# EasyEDA schematic SCH_stm32f407modular_2024-06-24.json
TITLE: Sheet_1; REV: 1.0; Date: 2024-01-05; Sheet: 1/1; Drawn By: Araf Israk; Company: Your Company
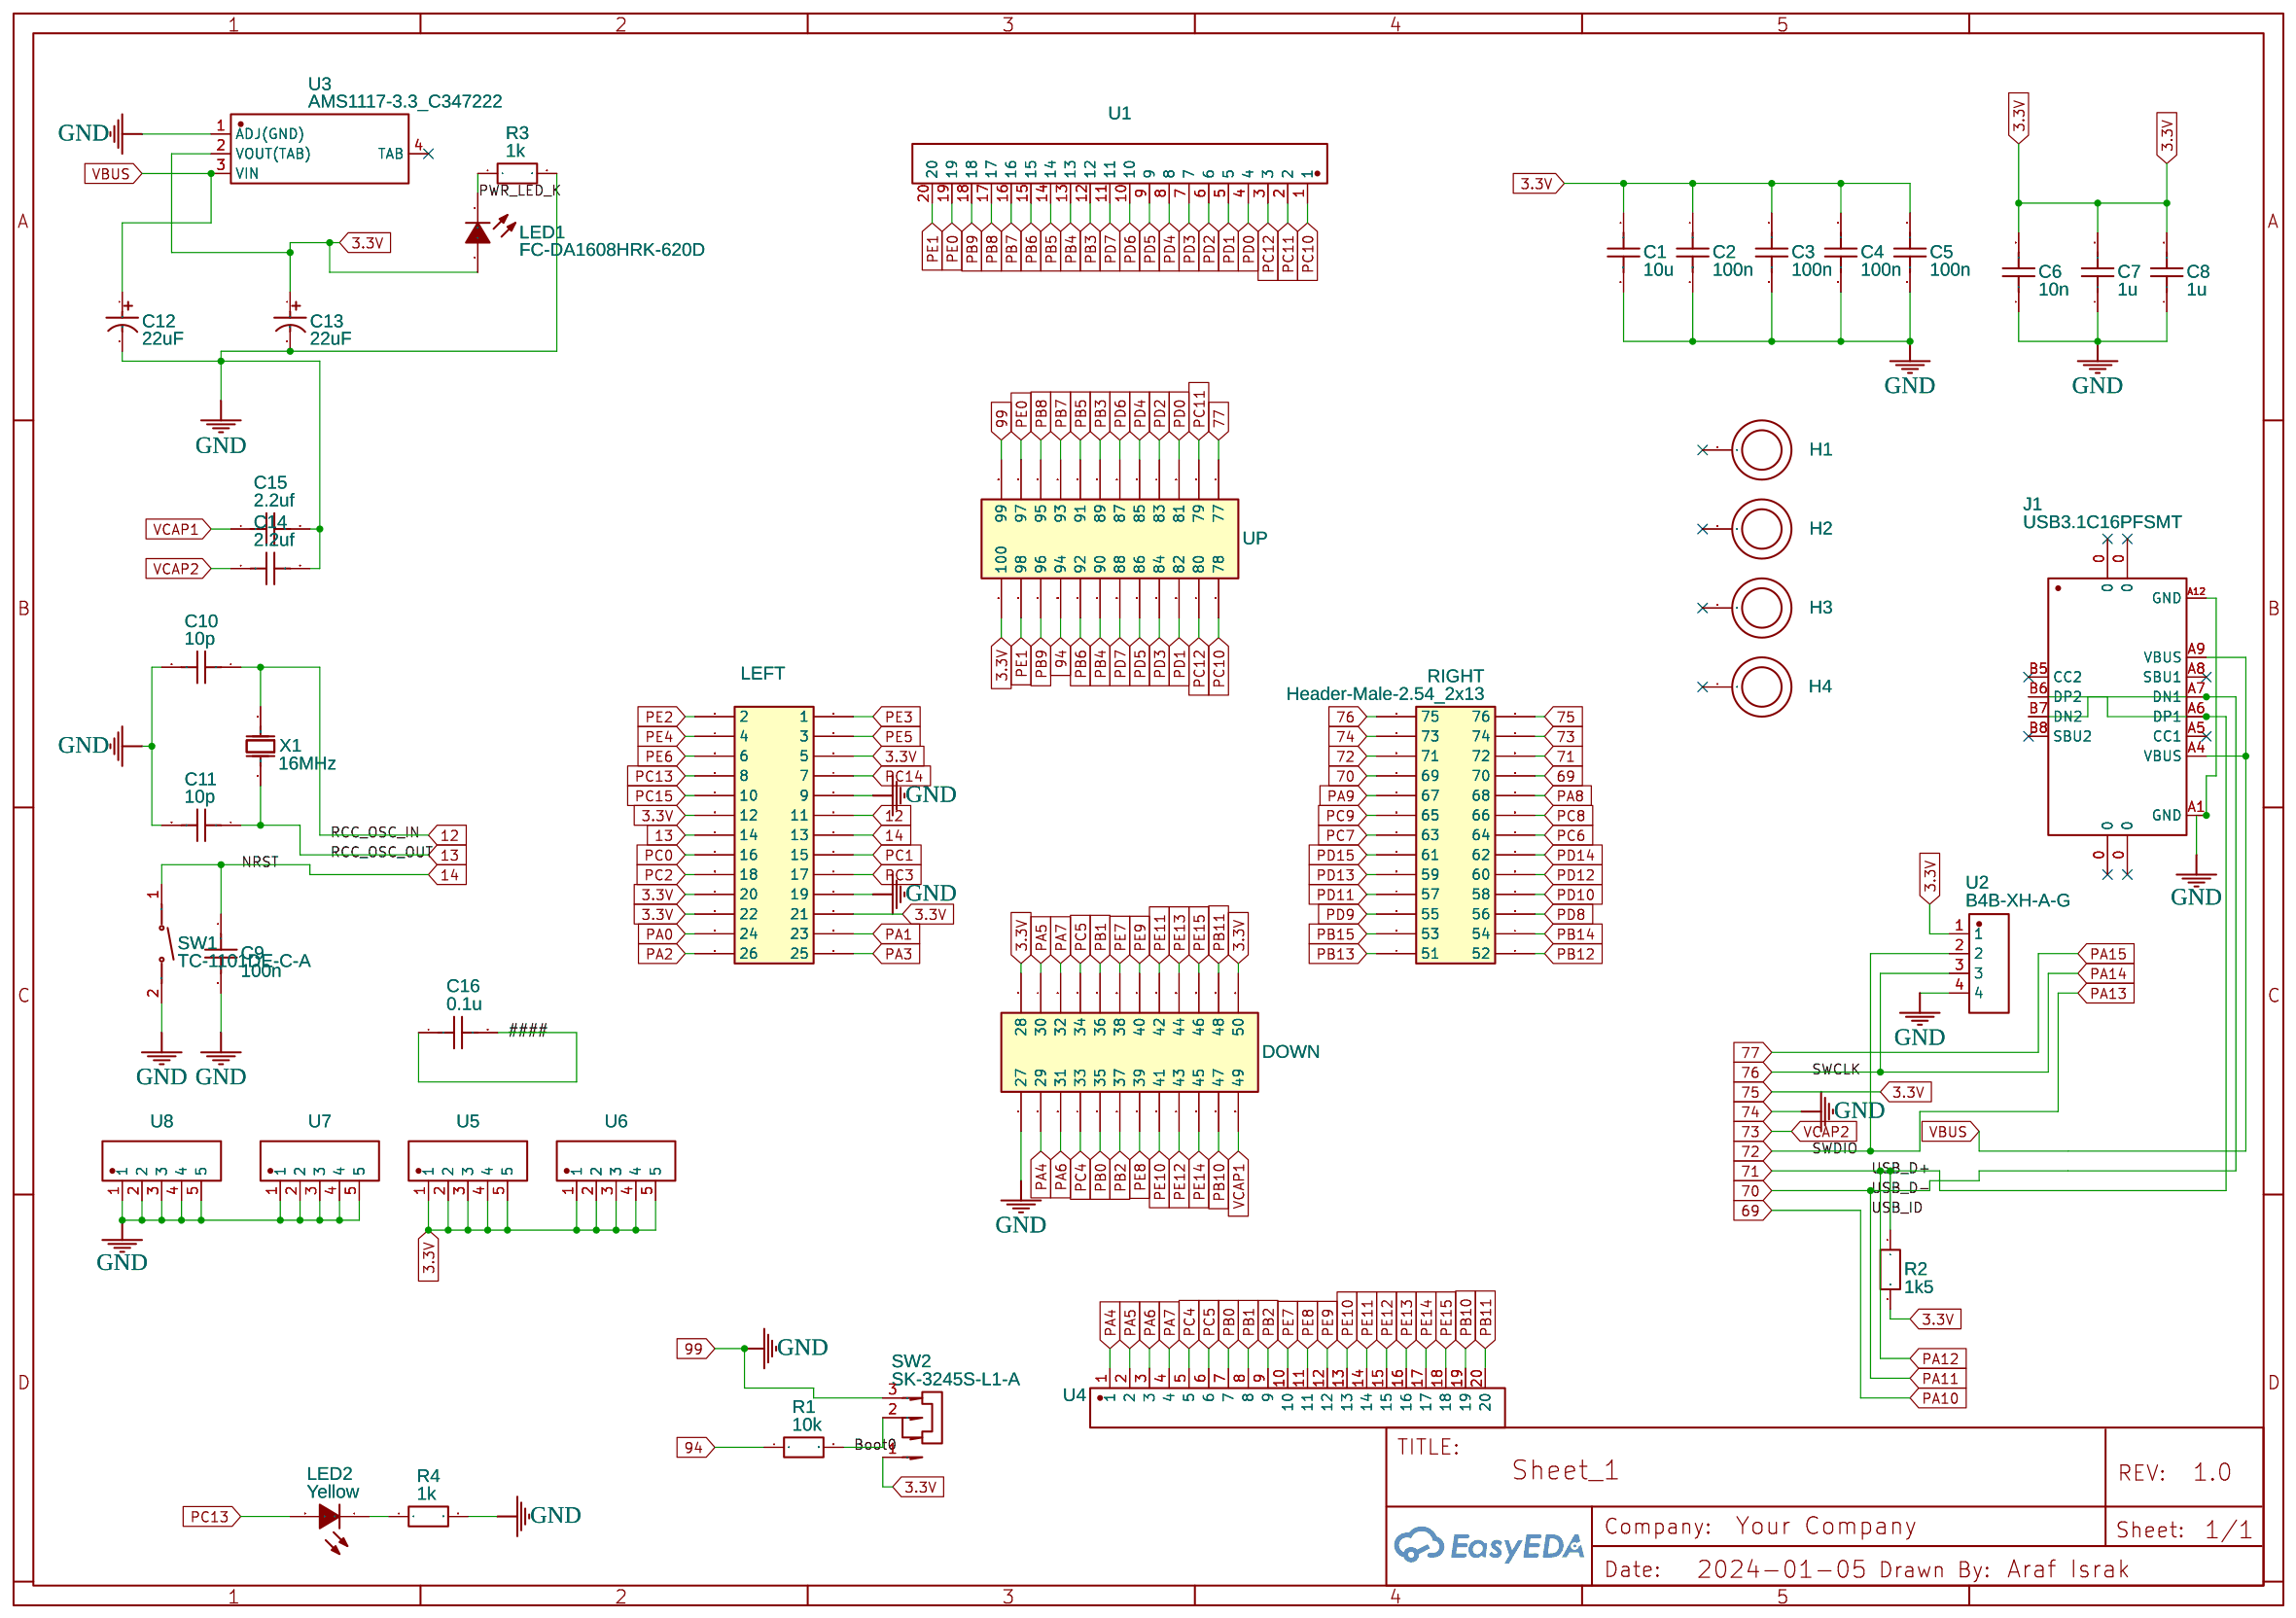
[diagram p0: schematic sheet]

## Parts
C1  10u  [C1206]
C2  100n  [C1206]
C3  100n  [C1206]
C4  100n  [C1206]
C5  100n  [C1206]
C6  10n  [C1206]
C7  1u  [C1206]
C8  1u  [C1206]
C9  100n  [C1206]
C10  10p  [C1206]
C11  10p  [C1206]
C12  22uF  [CAP-SMD_BD5.0-L5.3-W5.3-LS6.3-FD]
C13  22uF  [CAP-SMD_BD5.0-L5.3-W5.3-LS6.3-FD]
C14  2.2uf  [C1206]
C15  2.2uf  [C1206]
C16  0.1u  [C0603]
DOWN  Header-Female-2.54_2x12 copy  [HDR2X12]
H1  MOUNTINGHOLE_3.2MM_M3  [HOLEHOLE]
H2  MOUNTINGHOLE_3.2MM_M3  [HOLEHOLE]
H3  MOUNTINGHOLE_3.2MM_M3  [HOLEHOLE]
H4  MOUNTINGHOLE_3.2MM_M3  [HOLEHOLE]
J1  USB3.1C16PFSMT  [USB-C-SMD_TYPE-C-USB-17]
LED1  FC-DA1608HRK-620D  [LED0603-RD_RED]
LED2  Yellow  [LED0603-RD_RED]
LEFT  Header-Male-2.54_2x13  [HEADER_2.24_2X13_MOTOROLA]
R1  10k  [R1206]
R2  1k5  [R1206]
R3  1k  [R1206]
R4  1k  [R1206]
RIGHT  Header-Male-2.54_2x13  [HEADER_2.24_2X13_MOTOROLA]
SW1  TC-1101DE-C-A  [KEY-TH_L6.1-W3.8-P5.08]
SW2  SK-3245S-L1-A  [SW-SMD_SK-3245S-L1-A-1]
U1  P125-1120A0BR138A1  [HDR-TH_20P-P2.54-H-M-W9.7]
U2  B4B-XH-A-G  [CONN-TH_B4B-XH-A-G]
U3  AMS1117-3.3_C347222  [SOT-223-4_L6.5-W3.5-P2.30-LS7.0-BR]
U4  P125-1120A0BR138A1  [HDR-TH_20P-P2.54-H-M-W9.7]
U5  P125-1105A0BR138A1  [HDR-TH_5P-P2.54-H-M-W10.4]
U6  P125-1105A0BR138A1  [HDR-TH_5P-P2.54-H-M-W10.4]
U7  P125-1105A0BR138A1  [HDR-TH_5P-P2.54-H-M-W10.4]
U8  P125-1105A0BR138A1  [HDR-TH_5P-P2.54-H-M-W10.4]
UP  Header-Female-2.54_2x12 copy  [HDR2X12]
X1  16MHz  [CRYSTAL-TH_L11.1-W4.7]

## Library data of the parts
C1-C11 C14-C16 = C_0603_US: Contributor: LCEDA_Lib
C12 C13 = RVT1V220M0505: Supplier: LCSC; Manufacturer: ROQANG(容强); Supplier Part: C72504; JLCPCB Part Class: Extended Part; link: https://lcsc.com/eda_search?q=C72504&%26type=1&ref=editor
DOWN UP = Header-Female-2.54_2x12 copy: EasyEDA: C64320; Supplier Part: C64320; Supplier: EasyEDA; Manufacturer: EasyEDA; Manufacturer Part: Header-Female-2.54_2x13
H1-H4 = MOUNTINGHOLE_3.2MM_M3: Contributor: Cillié Malan
J1 = USB3.1C16PFSMT: Supplier: LCSC; Supplier Part: C167321; Manufacturer: LCSC; Contributor: hds110323; JLCPCB Part Class: Extended Part
LED1 LED2 = FC-DA1608HRK-620D: Supplier: LCSC; Manufacturer: 国星光电; Manufacturer Part: NCD0603R1; Supplier Part: C84263; JLCPCB Part Class: Extended Part; link: https://lcsc.com/eda_search?q=C84263&%26type=1&ref=editor
LEFT RIGHT = Header-Male-2.54_2x13: Contributor: ikrajinovic
R1-R4 = R_0603_EU: Contributor: LCEDA_Lib
SW1 = TC-1101DE-C-A: Contributor: LCSC; Supplier: LCSC; Supplier Part: C318995; Manufacturer: XKB Connectivity(中国星坤); JLCPCB Part Class: Extended Part; link: https://lcsc.com/eda_search?q=C318995&%26type=1&ref=editor
SW2 = SK-3245S-L1-A: Contributor: LCSC; Supplier: LCSC; Supplier Part: C405951; Manufacturer: XKB Connectivity(中国星坤); JLCPCB Part Class: Extended Part; link: https://lcsc.com/eda_search?q=C405951&%26type=1&ref=editor
U1 U4 = P125-1120A0BR138A1: Supplier: LCSC; Supplier Part: C19190491; Manufacturer: Yxcon(宇熙精密); Contributor: lcsc
U2 = B4B-XH-A-G: Contributor: LCSC; Supplier: LCSC; Supplier Part: C594232; Manufacturer: JST; JLCPCB Part Class: Extended Part; link: https://lcsc.com/eda_search?q=C594232&%26type=1&ref=editor
U3 = AMS1117-3.3_C347222: Contributor: LCSC; Supplier: LCSC; Supplier Part: C347222; Manufacturer: UMW(广东友台半导体); Manufacturer Part: AMS1117-3.3; JLCPCB Part Class: Extended Part; link: https://lcsc.com/eda_search?q=C347222&%26type=1&ref=editor
U5-U8 = P125-1105A0BR138A1: Supplier: LCSC; Supplier Part: C19190479; Manufacturer: Yxcon(宇熙精密); Contributor: lcsc
X1 = S1C12000ZWFAC: Contributor: LCSC; Supplier: LCSC; Supplier Part: C2149380; Manufacturer: JYJE(晶友嘉); JLCPCB Part Class: Extended Part; link: https://lcsc.com/eda_search?q=C2149380&%26type=1&ref=editor

## Nets
3.3V: C1.1 C2.1 C3.1 C4.1 C5.1 C6.2 C7.2 C8.2 C13.1 DOWN.2(28) DOWN.24(50) LED1.2(A) LEFT.5 LEFT.12 LEFT.20 LEFT.21 LEFT.22 R2.2 RIGHT.26(76) SW2.1 U2.1 U3.2(VOUT(TAB)) U5.1 U5.2 U5.3 U5.4 U5.5 U6.1 U6.2 U6.3 U6.4 U6.5 UP.24(100)
VBUS: C12.1 J1.A4(VBUS) J1.A9(VBUS) U3.3(VIN)
12: C10.1 LEFT.11 X1.2(OSC2)
13: C11.1 LEFT.14 X1.1(OSC1)
14: C9.1 LEFT.13 SW1.1
69: RIGHT.20(70)
70: J1.A7(DN1) J1.B7(DN2) RIGHT.19(69)
71: J1.A6(DP1) J1.B6(DP2) R2.1 RIGHT.22(72)
72: RIGHT.21(71) U2.2
73: C14.1 RIGHT.24(74)
74: C1.2 C2.2 C3.2 C4.2 C5.2 C6.1 C7.1 C8.1 C9.2 C10.2 C11.2 C12.2 C13.2 C14.2 C15.2 DOWN.1(27) J1.A1(GND) J1.A12(GND) LEFT.9 LEFT.19 R3.2 R4.2 RIGHT.23(73) SW1.2 SW2.3 U2.4 U3.1(ADJ(GND)) U7.1 U7.2 U7.3 U7.4 U7.5 U8.1 U8.2 U8.3 U8.4 U8.5 UP.23(99)
76: RIGHT.25(75) U2.3
77: UP.1(77)
94: R1.1 UP.18(94)
####: C16.1 C16.2
Boot0: R1.2 SW2.2
PA0: LEFT.24
PA1: LEFT.23
PA2: LEFT.26
PA3: LEFT.25
PA4: DOWN.3(29) U4.1
PA5: DOWN.4(30) U4.2
PA6: DOWN.5(31) U4.3
PA7: DOWN.6(32) U4.4
PA8: RIGHT.18(68)
PA9: RIGHT.17(67)
PB0: DOWN.9(35) U4.7
PB1: DOWN.10(36) U4.8
PB2: DOWN.11(37) U4.9
PB3: U1.12 UP.13(89)
PB4: U1.13 UP.14(90)
PB5: U1.14 UP.15(91)
PB6: U1.15 UP.16(92)
PB7: U1.16 UP.17(93)
PB8: U1.17 UP.19(95)
PB9: U1.18 UP.20(96)
PB10: DOWN.21(47) U4.19
PB11: DOWN.22(48) U4.20
PB12: RIGHT.2(52)
PB13: RIGHT.1(51)
PB14: RIGHT.4(54)
PB15: RIGHT.3(53)
PC0: LEFT.16
PC1: LEFT.15
PC2: LEFT.18
PC3: LEFT.17
PC4: DOWN.7(33) U4.5
PC5: DOWN.8(34) U4.6
PC6: RIGHT.14(64)
PC7: RIGHT.13(63)
PC8: RIGHT.16(66)
PC9: RIGHT.15(65)
PC10: U1.1 UP.2(78)
PC11: U1.2 UP.3(79)
PC12: U1.3 UP.4(80)
PC13: LED2.2(A) LEFT.8
PC14: LEFT.7
PC15: LEFT.10
PD0: U1.4 UP.5(81)
PD1: U1.5 UP.6(82)
PD2: U1.6 UP.7(83)
PD3: U1.7 UP.8(84)
PD4: U1.8 UP.9(85)
PD5: U1.9 UP.10(86)
PD6: U1.10 UP.11(87)
PD7: U1.11 UP.12(88)
PD8: RIGHT.6(56)
PD9: RIGHT.5(55)
PD10: RIGHT.8(58)
PD11: RIGHT.7(57)
PD12: RIGHT.10(60)
PD13: RIGHT.9(59)
PD14: RIGHT.12(62)
PD15: RIGHT.11(61)
PE0: U1.19 UP.21(97)
PE1: U1.20 UP.22(98)
PE2: LEFT.2
PE3: LEFT.1
PE4: LEFT.4
PE5: LEFT.3
PE6: LEFT.6
PE7: DOWN.12(38) U4.10
PE8: DOWN.13(39) U4.11
PE9: DOWN.14(40) U4.12
PE10: DOWN.15(41) U4.13
PE11: DOWN.16(42) U4.14
PE12: DOWN.17(43) U4.15
PE13: DOWN.18(44) U4.16
PE14: DOWN.19(45) U4.17
PE15: DOWN.20(46) U4.18
PWR_LED_K: LED1.1(K) R3.1
VCAP1: C15.1 DOWN.23(49)
Net-(LED2-1): LED2.1(K) R4.1

Not connected (* = marked no-connect by the designer): H1 1*; H2 1*; H3 1*; H4 1*; J1 0* A5(CC1)* A8(SBU1)* B5(CC2)* B8(SBU2)*; U3 4(TAB)*
